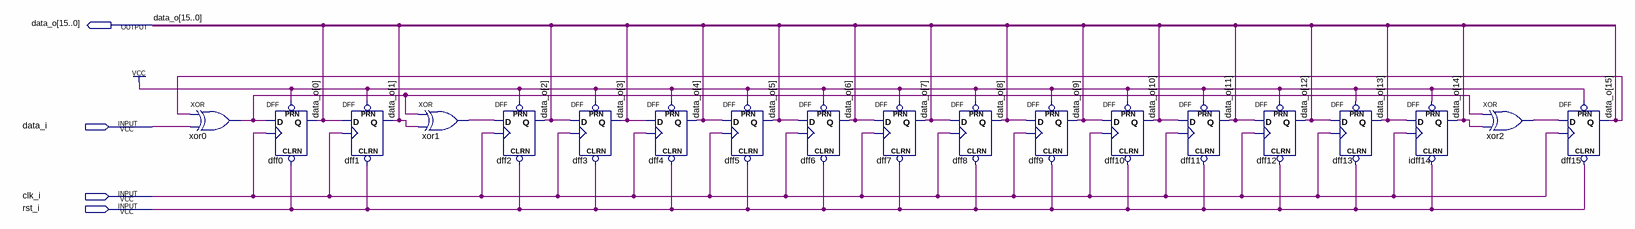
[diagram p0: schematic sheet]
// Quartus schematic top_crc_16_ansi.bdf as structural Verilog: 19 symbols, 4 pins
module top_crc_16_ansi (
  input  data_i,
  input  clk_i,
  input  rst_i,
  output [15:0] data_o
);

  wire xor0_out, xor1_out, xor2_out;

  xor xor0 (xor0_out, data_o[15], data_i);
  DFF dff0 (.CLRN(rst_i), .CLK(clk_i), .D(xor0_out), .PRN(1'b1), .Q(data_o[0]));
  DFF dff1 (.CLRN(rst_i), .CLK(clk_i), .D(data_o[0]), .PRN(1'b1), .Q(data_o[1]));
  xor xor1 (xor1_out, xor0_out, data_o[1]);
  DFF dff2 (.CLRN(rst_i), .CLK(clk_i), .D(xor1_out), .PRN(1'b1), .Q(data_o[2]));
  DFF dff3 (.CLRN(rst_i), .CLK(clk_i), .D(data_o[2]), .PRN(1'b1), .Q(data_o[3]));
  DFF dff4 (.CLRN(rst_i), .CLK(clk_i), .D(data_o[3]), .PRN(1'b1), .Q(data_o[4]));
  DFF dff5 (.CLRN(rst_i), .CLK(clk_i), .D(data_o[4]), .PRN(1'b1), .Q(data_o[5]));
  DFF dff6 (.CLRN(rst_i), .CLK(clk_i), .D(data_o[5]), .PRN(1'b1), .Q(data_o[6]));
  DFF dff7 (.CLRN(rst_i), .CLK(clk_i), .D(data_o[6]), .PRN(1'b1), .Q(data_o[7]));
  DFF dff8 (.CLRN(rst_i), .CLK(clk_i), .D(data_o[7]), .PRN(1'b1), .Q(data_o[8]));
  DFF dff9 (.CLRN(rst_i), .CLK(clk_i), .D(data_o[8]), .PRN(1'b1), .Q(data_o[9]));
  DFF dff10 (.CLRN(rst_i), .CLK(clk_i), .D(data_o[9]), .PRN(1'b1), .Q(data_o[10]));
  DFF dff11 (.CLRN(rst_i), .CLK(clk_i), .D(data_o[10]), .PRN(1'b1), .Q(data_o[11]));
  DFF dff12 (.CLRN(rst_i), .CLK(clk_i), .D(data_o[11]), .PRN(1'b1), .Q(data_o[12]));
  DFF dff13 (.CLRN(rst_i), .CLK(clk_i), .D(data_o[12]), .PRN(1'b1), .Q(data_o[13]));
  DFF idff14 (.CLRN(rst_i), .CLK(clk_i), .D(data_o[13]), .PRN(1'b1), .Q(data_o[14]));
  xor xor2 (xor2_out, xor0_out, data_o[14]);
  DFF dff15 (.CLRN(rst_i), .CLK(clk_i), .D(xor2_out), .PRN(1'b1), .Q(data_o[15]));
endmodule
